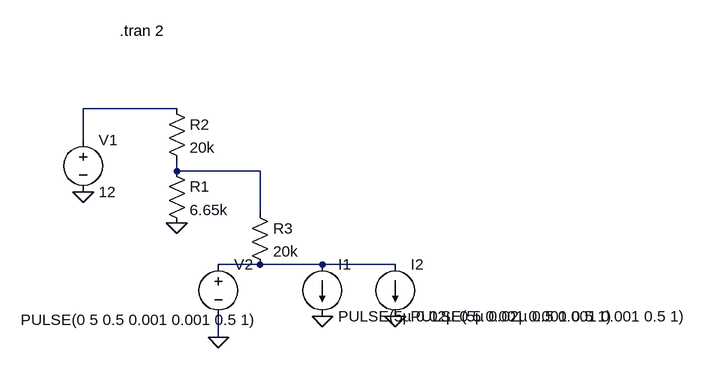
[diagram p0: schematic simu ON-OFF LM2596s.asc]
simu ON-OFF LM2596s.asc, the LTspice schematic file:
Version 4
SHEET 1 988 680
WIRE 176 32 32 32
WIRE 32 80 32 32
WIRE 176 128 176 112
WIRE 304 128 176 128
WIRE 304 192 304 128
WIRE 304 272 240 272
WIRE 400 272 304 272
WIRE 512 272 400 272
WIRE 240 384 240 352
FLAG 32 160 0
FLAG 176 208 0
FLAG 400 352 0
FLAG 240 384 0
FLAG 512 352 0
SYMBOL res 160 112 R0
SYMATTR InstName R1
SYMATTR Value 6.65k
SYMBOL res 160 16 R0
SYMATTR InstName R2
SYMATTR Value 20k
SYMBOL voltage 32 64 R0
WINDOW 123 0 0 Left 0
WINDOW 39 0 0 Left 0
SYMATTR InstName V1
SYMATTR Value 12
SYMBOL res 288 176 R0
SYMATTR InstName R3
SYMATTR Value 20k
SYMBOL current 400 272 R0
WINDOW 123 0 0 Left 0
WINDOW 39 0 0 Left 0
SYMATTR InstName I1
SYMATTR Value PULSE(5µ 0.02µ 0.5 0.001 0.001 0.5 1)
SYMBOL voltage 240 256 R0
WINDOW 3 -304 101 Left 2
WINDOW 123 0 0 Left 0
WINDOW 39 0 0 Left 0
SYMATTR InstName V2
SYMATTR Value PULSE(0 5 0.5 0.001 0.001 0.5 1)
SYMBOL current 512 272 R0
WINDOW 123 0 0 Left 0
WINDOW 39 0 0 Left 0
SYMATTR InstName I2
SYMATTR Value PULSE(5µ 0.02µ 0.5 0.001 0.001 0.5 1)
TEXT 88 -88 Left 2 !.tran 2

The netlist it stands for:
* simu ON-OFF LM2596s.asc
R1 N002 0 6.65k
R2 N001 N002 20k
V1 N001 0 12
R3 N002 N003 20k
I1 N003 0 PULSE(5µ 0.02µ 0.5 0.001 0.001 0.5 1)
V2 N003 0 PULSE(0 5 0.5 0.001 0.001 0.5 1)
I2 N003 0 PULSE(5µ 0.02µ 0.5 0.001 0.001 0.5 1)
.tran 2
.backanno
.end